# EAGLE design Dashboard rev2 (EAGLE 9.6.2)
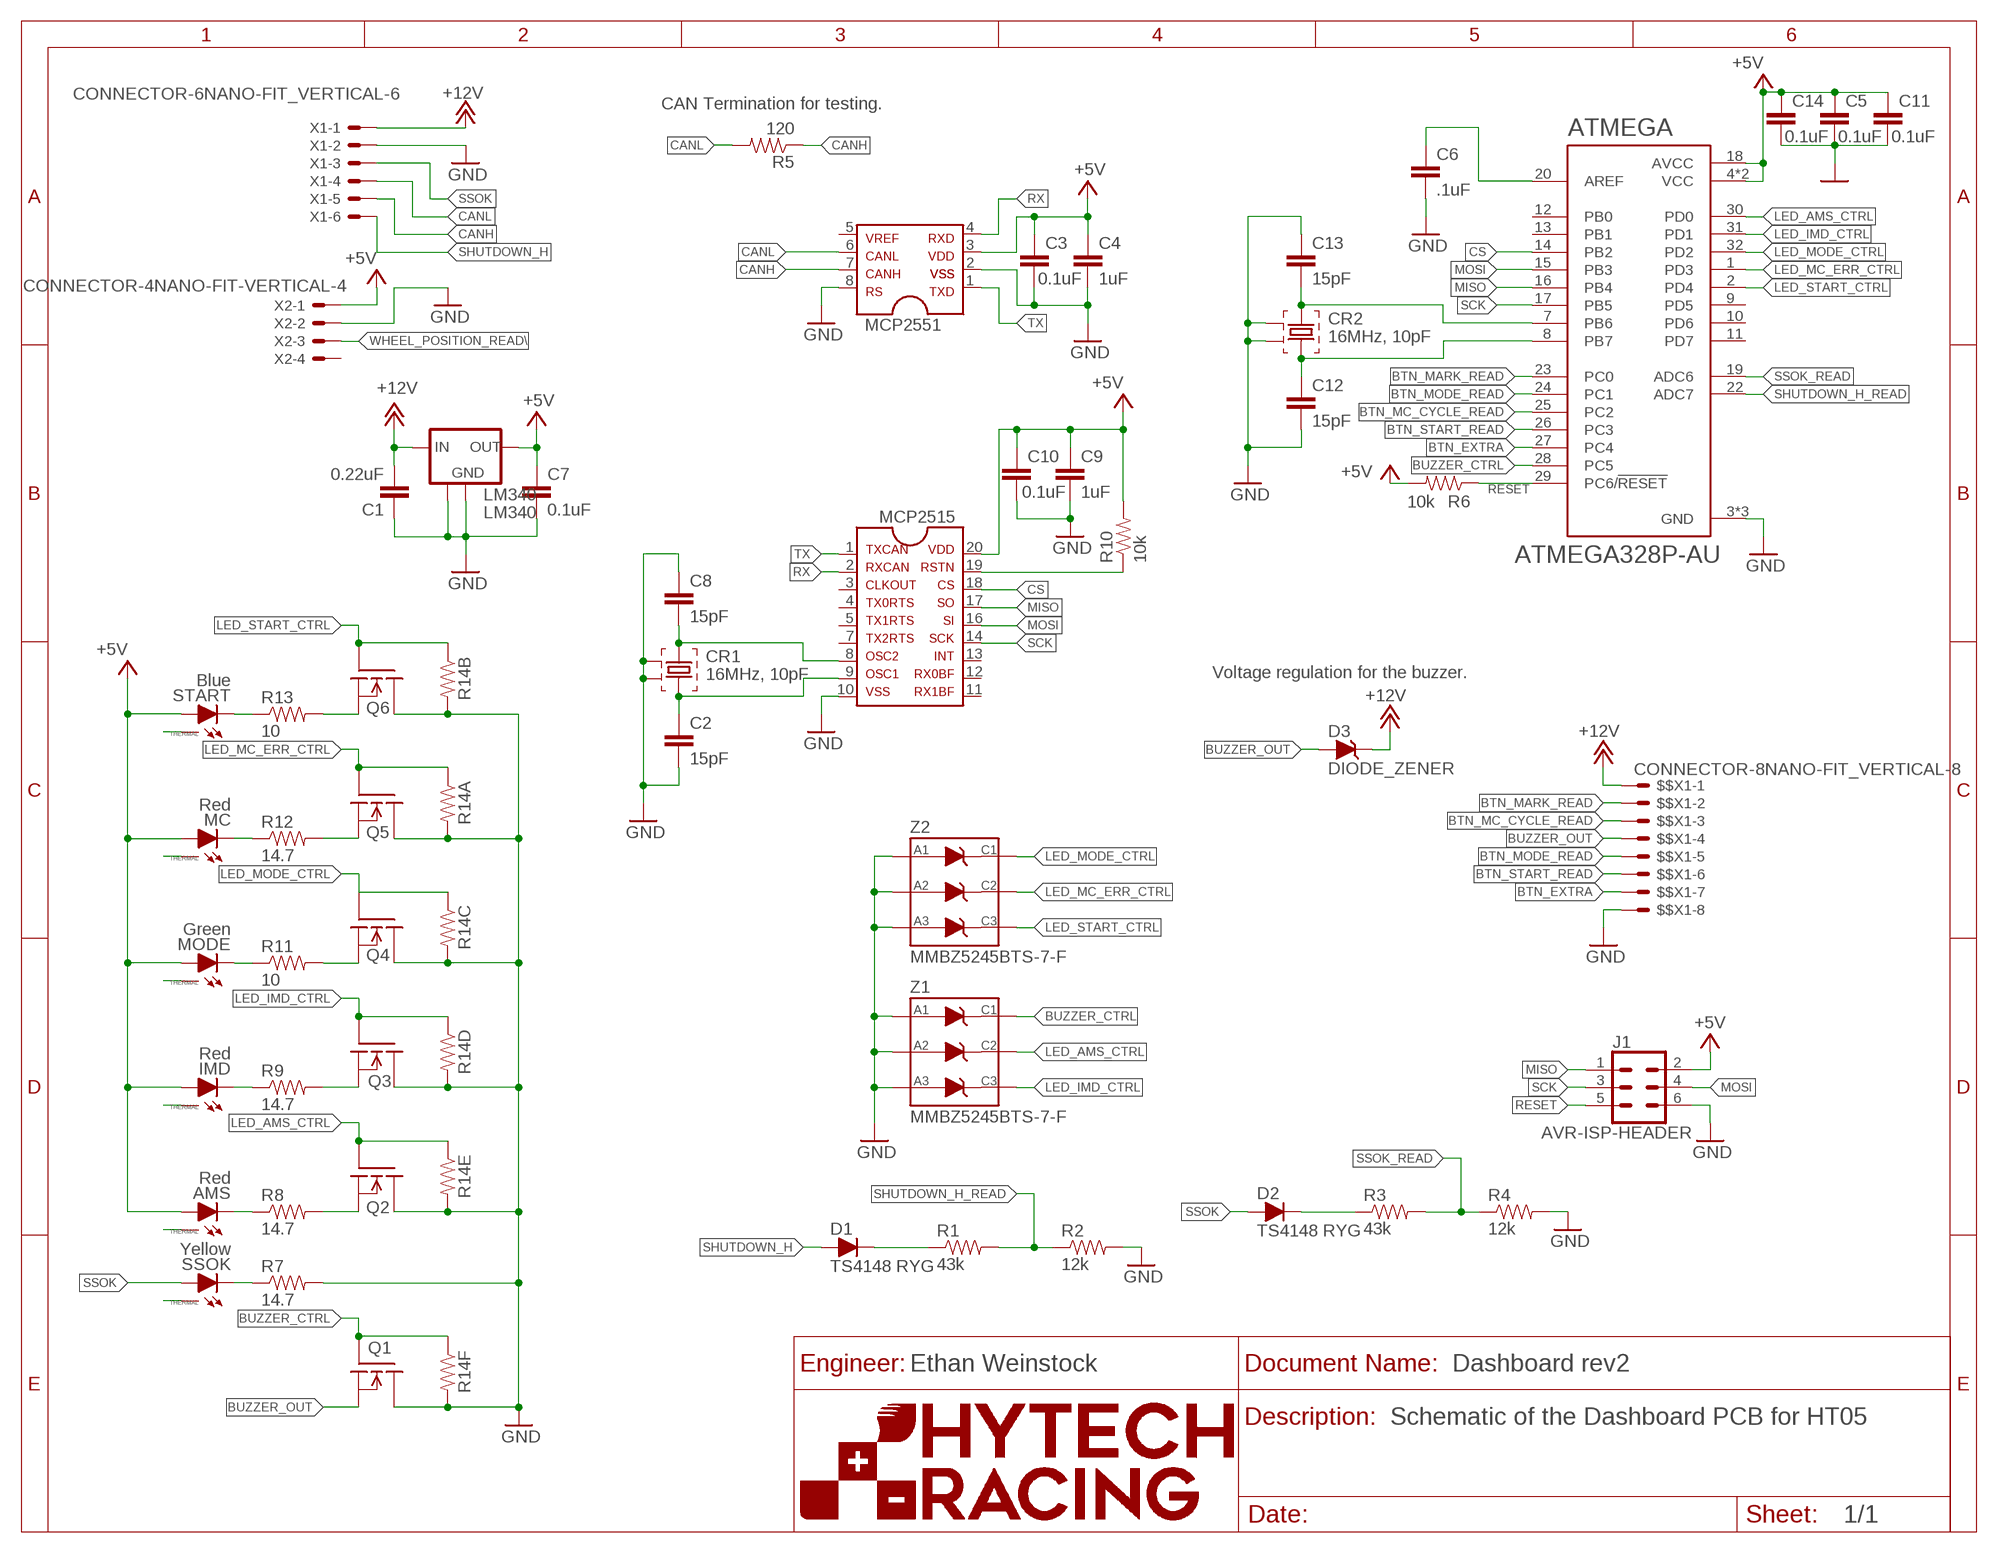
[diagram p0: schematic, sheet 1]
U$1 (FRAME_A_L): ORIENTATION: LANDSCAPE; SIZE: A

## Parts
$$X1  CONNECTOR-8NANO-FIT_VERTICAL-8  [NANO-FIT_VERTICAL-8]
AMS  Red  XP-E2XP-E2  [XP-E2]
ATMEGA  ATMEGA328P-AU  [QFP80P900X900X120-32N]
C1  0.22uF  CAP0603-CAP  [0603-CAP]
C2  15pF  CAP0603-CAP  [0603-CAP]
C3  0.1uF  CAP0603-CAP  [0603-CAP]
C4  1uF  CAP0603-CAP  [0603-CAP]
C5  0.1uF  CAP0603-CAP  [0603-CAP]
C6  .1uF  CAP0603-CAP  [0603-CAP]
C7  0.1uF  CAP0603-CAP  [0603-CAP]
C8  15pF  CAP0603-CAP  [0603-CAP]
C9  1uF  CAP0603-CAP  [0603-CAP]
C10  0.1uF  CAP0603-CAP  [0603-CAP]
C11  0.1uF  CAP0603-CAP  [0603-CAP]
C12  15pF  CAP0603-CAP  [0603-CAP]
C13  15pF  CAP0603-CAP  [0603-CAP]
C14  0.1uF  CAP0603-CAP  [0603-CAP]
CR1  16MHz, 10pF  ABM3B  [ABM3B]
CR2  16MHz, 10pF  ABM3B  [ABM3B]
D1  TS4148 RYG  DIODE0805  [0805_D]
D2  TS4148 RYG  DIODE0805  [0805_D]
D3  DIODE_ZENER  [SOT23]
IMD  Red  XP-E2XP-E2  [XP-E2]
J1  AVR-ISP-HEADER  [2X03]
LM340  LM340  [SOT223]
MC  Red  XP-E2XP-E2  [XP-E2]
MCP2515  MCP2515TSSOP  [TSSOP-20]
MCP2551  MCP2551  [SOIC-08]
MODE  Green  XP-E2XP-E2  [XP-E2]
Q1  DMG3406LSOT  [SOT23]
Q2  DMG3406LSOT  [SOT23]
Q3  DMG3406LSOT  [SOT23]
Q4  DMG3406LSOT  [SOT23]
Q5  DMG3406LSOT  [SOT23]
Q6  DMG3406LSOT  [SOT23]
R1  43k  RESISTOR0603  [0603-RES]
R2  12k  RESISTOR0603  [0603-RES]
R3  43k  RESISTOR0603  [0603-RES]
R4  12k  RESISTOR0603  [0603-RES]
R5  120  RESISTOR0603-RES  [0603-RES]
R6  10k  RESISTOR0603  [0603-RES]
R7  14.7  RESISTOR0603  [0603-RES]
R8  14.7  RESISTOR0603  [0603-RES]
R9  14.7  RESISTOR0603  [0603-RES]
R10  10k  RESISTOR0603  [0603-RES]
R11  10  RESISTOR0603  [0603-RES]
R12  14.7  RESISTOR0603  [0603-RES]
R13  10  RESISTOR0603  [0603-RES]
R14  10k  YC248-JR-0710KL  [YAG_YC248-M]
SSOK  Yellow  XP-E2XP-E2  [XP-E2]
START  Blue  XP-E2XP-E2  [XP-E2]
X1  CONNECTOR-6NANO-FIT_VERTICAL-6  [NANO-FIT_VERTICAL-6]
X2  CONNECTOR-4NANO-FIT-VERTICAL-4  [NANO-FIT_VERTICAL-4]
Z1  MMBZ5245BTS-7-F  [SOT363]
Z2  MMBZ5245BTS-7-F  [SOT363]

## Nets
+5V: AMS.A ATMEGA.4(VCC) ATMEGA.6(VCC) ATMEGA.18(AVCC) C3.1 C4.1 C5.1 C7.1 C9.1 C10.1 C11.1 C14.1 IMD.A J1.2 LM340.3(OUT) MC.A MCP2515.20(VDD) MCP2551.3 MODE.A R6.2 R10.2 START.A X2.P$1
+12V: $$X1.P$1 C1.2 D3.3(C) LM340.1(IN) X1.P$1
BTN_EXTRA: $$X1.P$7 ATMEGA.27(PC4)
BTN_MARK_READ: $$X1.P$2 ATMEGA.23(PC0)
BTN_MC_CYCLE_READ: $$X1.P$3 ATMEGA.25(PC2)
BTN_MODE_READ: $$X1.P$5 ATMEGA.24(PC1)
BTN_START_READ: $$X1.P$6 ATMEGA.26(PC3)
BUZZER_CTRL: ATMEGA.28(PC5) Q1.1(G) R14.6 Z1.P$4(C1)
BUZZER_OUT: $$X1.P$4 D3.1(A) Q1.2(S)
CANH: MCP2551.7 R5.1 X1.P$5
CANL: MCP2551.6 R5.2 X1.P$4
CS: ATMEGA.14(PB2) MCP2515.18(CS)
GND: $$X1.P$8 ATMEGA.3(GND) ATMEGA.5(GND) ATMEGA.21(GND) C1.1 C2.2 C3.2 C4.2 C5.2 C6.2 C7.2 C8.1 C9.2 C10.2 C11.2 C12.2 C13.1 C14.2 CR1.P$2 CR1.P$4 CR2.P$2 CR2.P$4 J1.6 LM340.2(GND) LM340.4(GND1) MCP2515.10(VSS) MCP2551.2 MCP2551.8 Q1.3(D) Q2.3(D) Q3.3(D) Q4.3(D) Q5.3(D) Q6.3(D) R2.2 R4.2 R7.2 R14.11 R14.12 R14.13 R14.14 R14.15 R14.16 X1.P$2 X2.P$2 Z1.P$1(A1) Z1.P$2(A2) Z1.P$3(A3) Z2.P$1(A1) Z2.P$2(A2) Z2.P$3(A3)
LED_AMS_CTRL: ATMEGA.30(PD0) Q2.1(G) R14.5 Z1.P$5(C2)
LED_IMD_CTRL: ATMEGA.31(PD1) Q3.1(G) R14.4 Z1.P$6(C3)
LED_MC_ERR_CTRL: ATMEGA.1(PD3) Q5.1(G) R14.1 Z2.P$5(C2)
LED_MODE_CTRL: ATMEGA.32(PD2) Q4.1(G) R14.3 Z2.P$4(C1)
LED_START_CTRL: ATMEGA.2(PD4) Q6.1(G) R14.2 Z2.P$6(C3)
MISO: ATMEGA.16(PB4) J1.1 MCP2515.17(SO)
MOSI: ATMEGA.15(PB3) J1.4 MCP2515.16(SI)
N$1: MCP2515.19(RSTN) R10.1
N$2: C2.1 CR1.P$3 MCP2515.9(OSC1)
N$3: C8.2 CR1.P$1 MCP2515.8(OSC2)
N$4: Q6.2(S) R13.2
N$5: ATMEGA.7(PB6) C13.2 CR2.P$1
N$6: ATMEGA.8(PB7) C12.1 CR2.P$3
N$7: D2.C R3.1
N$8: ATMEGA.20(AREF) C6.1
N$9: Q4.2(S) R11.2
N$10: MODE.C R11.1
N$11: R13.1 START.C
N$12: Q3.2(S) R9.2
N$13: IMD.C R9.1
N$14: D1.C R1.1
N$15: R7.1 SSOK.C
N$16: AMS.C R8.1
N$17: Q2.2(S) R8.2
N$18: Q5.2(S) R12.2
N$19: MC.C R12.1
RESET: ATMEGA.29(PC6/!RESET) J1.5 R6.1
RX: MCP2515.2(RXCAN) MCP2551.4
SCK: ATMEGA.17(PB5) J1.3 MCP2515.14(SCK)
SHUTDOWN_H: D1.A X1.P$6
SHUTDOWN_H_READ: ATMEGA.22(ADC7) R1.2 R2.1
SSOK: D2.A SSOK.A X1.P$3
SSOK_READ: ATMEGA.19(ADC6) R3.2 R4.1
THERMAL: AMS.X IMD.X MC.X MODE.X SSOK.X START.X
TX: MCP2515.1(TXCAN) MCP2551.1
WHEEL_POSITION_READ\: X2.P$3
Unconnected: ATMEGA.9(PD5) ATMEGA.10(PD6) ATMEGA.11(PD7) ATMEGA.12(PB0) ATMEGA.13(PB1) MCP2515.3(CLKOUT) MCP2515.4(TX0RTS) MCP2515.5(TX1RTS) MCP2515.7(TX2RTS) MCP2515.11(RX1BF) MCP2515.12(RX0BF) MCP2515.13(INT) MCP2551.5 R14.7 R14.8 R14.9 R14.10 X2.P$4

## Notes on the sheet
- CAN Termination for testing.
- Voltage regulation for the buzzer.
- Ethan Weinstock
- Schematic of the Dashboard PCB for HT05

## Library data of the parts
$$X1 = HyTechDevices:CONNECTOR-8: Mini-Fit Junior connector 8 pole Source: http://www.molex.com
AMS IMD MC MODE SSOK START = HyTechDevices:XP-E2: XP-E2 high-brightness LED. Data sheet <https://www.cree.com/led-components/media/documents/XLampXPE2.pdf>
ATMEGA = HyTechDevices:ATMEGA328P-AU: ATmega Series 20 MHz 32 KB Flash 2 KB SRAM 8-Bit Microcontroller - TQFP-32; AVAILABILITY: Unavailable; DESCRIPTION: AVR AVR® ATmega Microcontroller IC 8-Bit 20MHz 32KB _16K x 16_ FLASH 32-TQFP _7x7_; MF: Microchip; MP: ATMEGA328P-AU; PACKAGE: TQFP-32 Microchip; PRICE: None
C1-C14 = HyTechDevices:CAP: Capacitor Standard 0603 ceramic capacitor, and 0.1" leaded capacitor.
CR1 CR2 = HyTechDevices:ABM3B: ABM3B ceramic SMD crystal. Datasheet <https://www.mouser.com/datasheet/2/3/abm3b-39910.pdf>
D1 D2 = HyTechDevices:DIODE: DIODE general purpose rectifier
D3 = HyTechDevices:DIODE_ZENER: ZENER DIODE
J1 = HyTechDevices:AVR-ISP-HEADER: AVR ISP 6-pin Header Reference <https://en.wikipedia.org/wiki/In-system_programming>; DIGIKEY: S2011EC-03-ND
LM340 = HyTechDevices:LM340
MCP2515 = HyTechDevices:MCP2515: MCP2515 CAN Controller with SPI Interface Datasheet <http://ww1.microchip.com/downloads/en/DeviceDoc/21801G.pdf>
MCP2551 = HyTechDevices:MCP2551: MCP2551 High-Speed CAN Transceiver Product Webpage <https://www.microchip.com/wwwproducts/en/MCP2551> Datasheet <http://ww1.microchip.com/downloads/en/DeviceDoc/21667f.pdf> This device is outdated It is replaced by MCP2561. Comparison Page <https://www.microchip.com/wwwproducts/ProductCompare/MCP2551/MCP2561> Product Webpage <https://www.microchip.com/wwwproducts/en/MCP2561> Datasheet <http://ww1.microchip.com/downloads/en/DeviceDoc/20005167C.pdf>
Q1-Q6 = HyTechDevices:DMG3406L: Generic NPN MOSFET DMG3406L (SOT-23, 2.8 A 30V)
R1-R13 = HyTechDevices:RESISTOR: Resistor Basic schematic elements and footprints for 0603, 1206, and PTH resistors.
R14 = HyTechDevices:YC248-JR-0710KL: 10k 8-resistor array. Replaces Bourns Cat 16 Datasheet <https://www.yageo.com/upload/media/product/productsearch/datasheet/rchip/PYu-YC_TC_group_51_RoHS_L_9.pdf>; BUILT_BY: EMA_UL_Team; MANUFACTURER_PART_NUMBER: YC248-JR-0710KL; VENDOR: Yageo
X1 = HyTechDevices:CONNECTOR-6: Mini-Fit Junior connector 6 pole Source: http://www.molex.com
X2 = HyTechDevices:CONNECTOR-4: Mini-Fit Junior connector 4 pole Source: http://www.molex.com
Z1 Z2 = HyTechDevices:MMBZ5245BTS-7-F: 15V Zener Diode Array 3 Independent with SOT363 footprint. Datasheet <https://www.mouser.com/datasheet/2/115/ds30184-1382386.pdf>; VOLTAGE: 15V

## Board
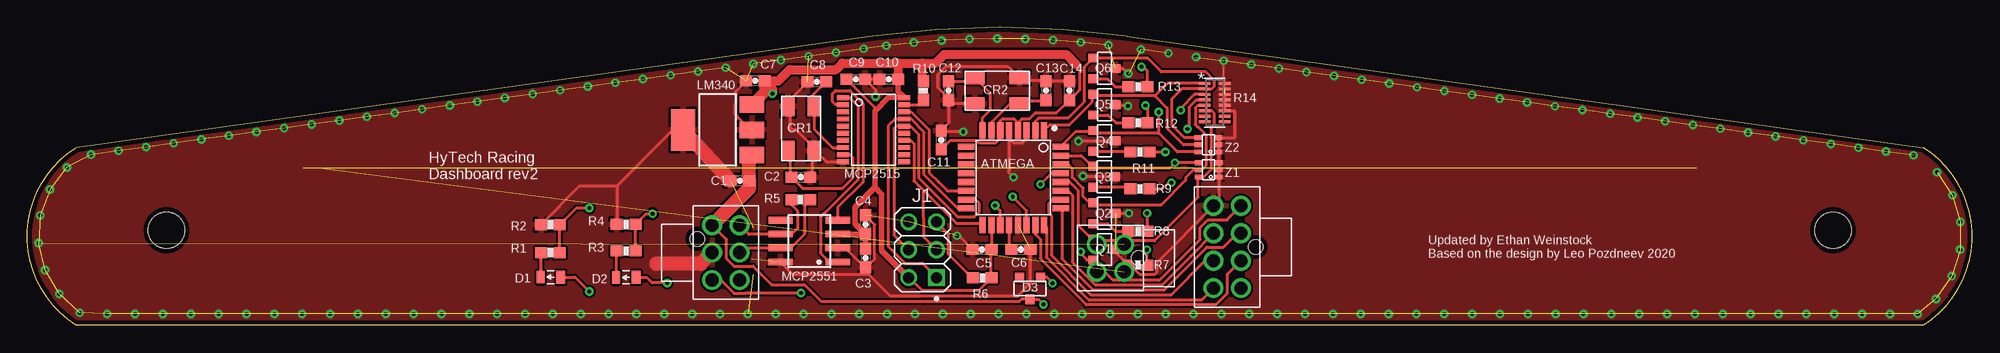
[diagram p1: board, top side]
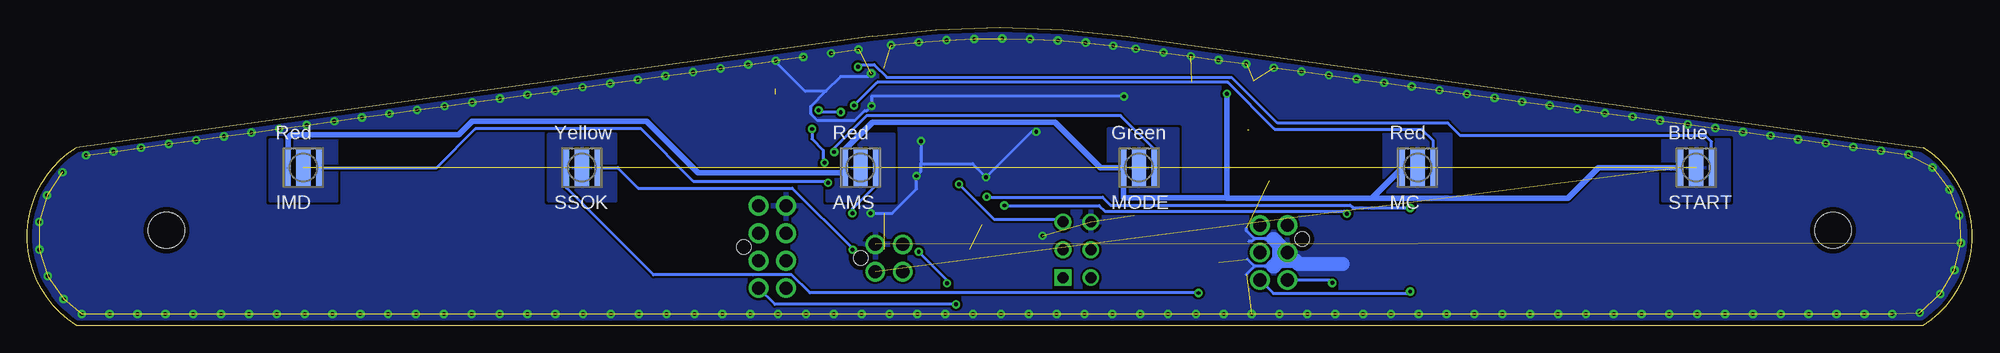
[diagram p2: board, bottom side, seen from below]

Size 177.34 x 27.14 mm. Coordinates in mm from the lower left corner, seen from the top.
Outline: 100.26,26.32 arc16 77.08,26.32 4.45,16.19 arc115 4.45,0 172.89,0 arc115 172.89,16.19 100.26,26.32
Copper layers (1*16): Top 0.035mm / dielectric 1.53mm / Bottom 0.035mm
Design rules "HyTech Default (2 Layer)": minimum track width 8mil, minimum drill 0.3mm, track to track 8mil, track to pad 8mil, pad to pad 8mil, via to via 22mil, smd to smd 8mil, copper to edge 17mil, drill to drill 23mil, minimum pad ring 9mil, minimum via ring 8mil, stop-mask expansion 8mil, vias tented up to drill 30mil, thermal gap 10mil
Holes 3.3 mm at 12.69,8.65 164.65,8.65

### Footprints (pad centres in the part's own frame; a part is rotated, then mirrored left to right if it is on the bottom)
NANO-FIT_VERTICAL-8 = drill 1.2: P$1 -3.75,0; P$2 -1.25,0; P$3 1.25,0; P$4 3.75,0; P$5 -3.75,2.5; P$6 -1.25,2.5; P$7 1.25,2.5; P$8 3.75,2.5 | hole 1.3: 0,-1.34
XP-E2 = smd 0.5 x 3.3: A -1.4,0; C 1.4,0 | smd 1.3 x 3.3: X 0,0
QFP80P900X900X120-32N = smd 1.5 x 0.55: 1 -4.3,2.8; 2 -4.3,2; 3 -4.3,1.2; 4 -4.3,0.4; 5 -4.3,-0.4; 6 -4.3,-1.2; 7 -4.3,-2; 8 -4.3,-2.8; 17 4.3,-2.8; 18 4.3,-2; 19 4.3,-1.2; 20 4.3,-0.4; 21 4.3,0.4; 22 4.3,1.2; 23 4.3,2; 24 4.3,2.8 | smd 0.55 x 1.5: 9 -2.8,-4.3; 10 -2,-4.3; 11 -1.2,-4.3; 12 -0.4,-4.3; 13 0.4,-4.3; 14 1.2,-4.3; 15 2,-4.3; 16 2.8,-4.3; 25 2.8,4.3; 26 2,4.3; 27 1.2,4.3; 28 0.4,4.3; 29 -0.4,4.3; 30 -1.2,4.3; 31 -2,4.3; 32 -2.8,4.3
0603-CAP = smd 1.1 x 1: 1 -0.85,0; 2 0.85,0
ABM3B = smd 1.803 x 1.194: P$1 0.902,2.985; P$2 4.966,2.985; P$3 4.966,0.597; P$4 0.902,0.597
0805_D = smd 0.8 x 1.2: A -0.9,0; C 0.9,0
SOT23 = smd 0.8 x 0.9: 1 -0.95,-1; 2 0.95,-1; 3 0,1
2X03 = drill 1.016 square: 1 -2.54,-1.27 | drill 1.016: 2 -2.54,1.27; 3 0,-1.27; 4 0,1.27; 5 2.54,-1.27; 6 2.54,1.27
SOT223 = smd 1.5 x 2.235: 1 -2.3,-3.15; 2 0,-3.15; 3 2.3,-3.15 | smd 3.8 x 2.2: 4 0,3.15
TSSOP-20 = smd 0.45 x 1.1: 1 -2.925,-2.618; 2 -2.275,-2.618; 3 -1.625,-2.618; 4 -0.975,-2.618; 5 -0.325,-2.618; 6 0.325,-2.618; 7 0.975,-2.618; 8 1.625,-2.618; 9 2.275,-2.618; 10 2.925,-2.618; 11 2.925,2.918; 12 2.275,2.918; 13 1.625,2.918; 14 0.975,2.918; 15 0.325,2.918; 16 -0.325,2.918; 17 -0.975,2.918; 18 -1.625,2.918; 19 -2.275,2.918; 20 -2.925,2.918
SOIC-08 = smd 0.6 x 2.2: 1 -1.905,-2.6; 2 -0.635,-2.6; 3 0.635,-2.6; 4 1.905,-2.6; 5 1.905,2.6; 6 0.635,2.6; 7 -0.635,2.6; 8 -1.905,2.6
0603-RES = smd 1.1 x 1: 1 -0.85,0; 2 0.85,0
YAG_YC248-M = smd 1.067 x 0.254: 1 -0.902,1.75; 2 -0.902,1.25; 3 -0.902,0.75; 4 -0.902,0.25; 5 -0.902,-0.25; 6 -0.902,-0.75; 7 -0.902,-1.25; 8 -0.902,-1.75; 9 0.902,-1.75; 10 0.902,-1.25; 11 0.902,-0.75; 12 0.902,-0.25; 13 0.902,0.25; 14 0.902,0.75; 15 0.902,1.25; 16 0.902,1.75
NANO-FIT_VERTICAL-6 = drill 1.2: P$1 -2.5,0; P$2 0,0; P$3 2.5,0; P$4 -2.5,2.5; P$5 0,2.5; P$6 2.5,2.5 | hole 1.3: -1.25,-1.34
NANO-FIT_VERTICAL-4 = drill 1.2: P$1 -1.25,0; P$2 1.25,0; P$3 -1.25,2.5; P$4 1.25,2.5 | hole 1.3: 0,-1.34
SOT363 = smd 0.61 x 0.432: P$1 -0.965,0.673; P$2 -0.965,0.023; P$3 -0.965,-0.627; P$4 0.93,0.673; P$5 0.93,0.023; P$6 0.93,-0.627

### Placement (x,y rotation side)
$$X1  110.66,7.12 90 top
AMS  101.37,14.36 0 bottom
ATMEGA  89.91,13.45 270 top
C1  64.96,13.17 0 top
C2  70.53,13.5 0 top
C3  76.43,6.13 270 top
C4  76.43,9.15 90 top
C5  87.04,6.89 180 top
C6  90.6,6.89 0 top
C7  66.38,22.26 180 top
C8  71.98,22.18 0 top
C9  75.54,22.41 0 top
C10  78.56,22.41 180 top
C11  83.33,16.87 90 top
C12  83.99,21.37 270 top
C13  92.88,21.37 270 top
C14  95.02,21.37 90 top
CR1  68.75,20.86 270 top
CR2  91.36,23.15 180 top
D1  47.71,4.37 180 top
D2  54.6,4.36 180 top
D3  91.43,3.34 180 top
IMD  152.17,14.36 0 bottom
J1  81.63,6.87 90 top
LM340  62.93,17.79 90 top
MC  50.57,14.36 0 bottom
MCP2515  77.01,17.81 270 top
MCP2551  71.29,7.65 90 top
MODE  75.97,14.36 0 bottom
Q1  98.22,6.89 270 top
Q2  98.22,10.19 270 top
Q3  98.19,13.52 270 top
Q4  98.22,16.8 270 top
Q5  98.22,20.1 270 top
Q6  98.22,23.4 270 top
R1  47.69,6.62 0 top
R2  47.69,9.16 180 top
R3  54.6,6.77 0 top
R4  54.6,9.18 180 top
R5  70.52,11.44 180 top
R6  87.07,4.31 0 top
R7  101.27,5.47 180 top
R8  101.27,8.54 180 top
R9  101.46,12.42 180 top
R10  81.71,21.37 90 top
R11  101.46,15.78 180 top
R12  101.27,18.45 180 top
R13  101.27,21.73 180 top
R14  108.27,20.28 0 top
SSOK  126.77,14.36 0 bottom
START  25.17,14.36 0 bottom
X1  62.44,6.61 270 top
X2  100.01,6.11 90 top
Z1  107.69,14.17 180 top
Z2  107.67,16.46 180 top

### Tracks (layer width: path | path; a pad name or v marks a point on that pad's centre or on a via)
+5V  (via drill 0.35)  (1 unrouted)
  Top 0.254: ATMEGA.18 87.91,6.91 C5.1 87.89,4.34 R6.2 86.74,3.12 81.62,3.12 80.41,4.33 J1.2 | C11.1 84.16,16.85 86.5,16.85 86.73,16.61 88.3,16.61 88.72,17.03 88.72,17.74 ATMEGA.6 88.71,18.59 88.95,18.82 89.96,18.82 90.33,18.46 90.3,18.43 ATMEGA.4 90.32,18.44 90.7,18.83 91.39,18.83 91.93,19.36 93.85,19.36 C14.1 95.92,21.43 95.92,23.45 95.64,23.74 | 77.28,19.52 77.28,19.82 C9.1
  Top 0.406: MCP2515.20 79.89,20.78
  Top 0.508: J1.2 77.89,6.8 77.89,11.95 77.28,12.56 | C4.1 75.47,9.26 75.47,10.74 77.28,12.55 77.28,12.56 | C3.1 C4.1 | 77.28,12.56 77.28,19.52 78.54,20.78 79.89,20.78 79.96,20.78 79.41,21.33 C10.1 | MCP2551.3 73.91,8.3 C4.1
  Top 0.813: 79.41,23.88 74.33,23.88 73.74,23.29 69.51,23.29 68.48,22.26 C7.1 67.95,21.55 v67.95,21.09 | 79.41,23.88 81.62,23.88 | 81.62,23.88 82.81,23.88 83.61,24.68 94.69,24.68 95.64,23.74 | 79.41,23.88 C10.1 | R10.2 81.62,22.31 81.62,23.88
  Top 1.016: LM340.3 67.23,21.25 C7.1
  Bottom 0.508: v67.95,21.09 67.95,11.59 | 54.75,11.58 36.88,11.58 34.1,14.36 START.A | 67.95,11.59 77.37,11.59 MODE.A 79.5,14.36 83.64,18.51 100.29,18.51 102.77,16.03 102.77,15.54 AMS.A 102.77,13.91 116.16,13.91 120.86,18.61 136.76,18.61 138.01,17.35 153.29,17.35 153.57,17.07 IMD.A | MC.A 54.75,11.58 | 67.95,11.59 67.93,11.58 54.75,11.58
+12V  (via drill 0.35)
  Top 0.254: v92.65,1.89 92.2,2.34 D3.3 90.63,2.34 90.46,2.17 72.38,2.17 70.86,3.69 67.87,3.69 66.17,5.38 64.43,5.38 63.71,6.1 63.71,7.84 X1.P$1
  Top 1.27: X1.P$1 65.81,12.48 C1.2 65.81,15.22 LM340.1
  Bottom 0.254: v92.65,1.89 109.18,1.89 $$X1.P$1
BTN_EXTRA
  Top 0.254: ATMEGA.27 94.91,12.24 95.3,11.85 95.3,10.24 95.3,5.73 97.34,3.69 103.5,3.69 106.09,6.28 106.09,6.29 $$X1.P$7
BTN_MARK_READ
  Top 0.254: ATMEGA.23 91.91,8.28 92.36,7.83 92.36,6.05 96.58,1.84 108.37,1.84 109.39,2.86 109.39,4.6 $$X1.P$2
BTN_MC_CYCLE_READ
  Top 0.254: ATMEGA.25 94.33,10.53 94.33,6.05 97.15,3.23 103.69,3.23 107.56,7.1 109.08,7.1 110.35,8.37 $$X1.P$3
BTN_MODE_READ
  Top 0.254: ATMEGA.24 92.91,8.95 92.91,6.18 96.77,2.32 107.11,2.32 $$X1.P$5
BTN_START_READ
  Top 0.254: ATMEGA.26 93.52,11.44 93.13,11.06 93.13,10.22 93.36,9.98 93.36,6.37 96.96,2.78 104.31,2.78 107.4,5.87 $$X1.P$6
BUZZER_CTRL
  Top 0.254: ATMEGA.28 94.27,13.1 95,13.1 95.82,12.29 95.82,9.1 97.07,7.84 Q1.1 97.22,7.7 100.42,7.7 100.43,7.69 102.78,7.69 106.76,11.67 Z1.P$4 106.92,13.34 107.12,13.34 107.99,14.22 107.99,18.03 108.23,18.27 108.23,19.3 108,19.53 R14.6
BUZZER_OUT  (via drill 0.35)
  Top 0.254: v93.48,3.82 92.97,4.34 D3.1 | v96.05,6.68 96.05,6.49 96.6,5.94 Q1.2 97.22,5.89 98.96,4.15 103.29,4.15 106.93,7.8 106.93,8.88 107.65,9.6 109.39,9.6 $$X1.P$4
  Bottom 0.254: v96.05,6.68 93.48,4.11 v93.48,3.82
CANH
  Top 0.254: X1.P$5 65.32,6.99 68.35,6.99 68.38,7.02 MCP2551.7 69.58,7.02 70.87,8.3 70.87,10.93 R5.1
CANL
  Top 0.254: X1.P$4 65.79,8.26 68.35,8.26 68.38,8.29 MCP2551.6 68.75,8.34 69.74,8.34 70.26,8.86 70.26,10.38 69.67,10.96 R5.2
CS
  Top 0.254: MCP2515.18 80.58,19.44 82.23,17.79 82.23,13.9 83.08,13.05 83.89,12.24 ATMEGA.14
GND  (via drill 0.35)  (157 unrouted)
  Top 0.203: R14.16 v109.09,24.1
  Top 0.254: C3.2 76.32,5.28 74.46,7.15 74.02,7.15 MCP2551.2 | C4.2 76.43,9.99 77.26,9.16 77.26,6.02 76.51,5.28 C3.2 | C2.2 71.56,13.67 71.56,15.72 CR1.P$2 | CR1.P$2 71.85,15.9 72.86,14.88 MCP2515.10 | CR1.P$2 71.74,16.16 70.09,17.81 69.53,17.81 69.53,19.78 CR1.P$4 69.53,20.14 69.53,20.53 71.13,22.13 C8.1 | C10.2 C9.2 77.34,21.45 v77.34,20.84 | C7.2 64.56,21.29 64.55,19.2 65.94,17.81 | CR2.P$4 90.71,22.3 92.81,22.3 C13.1 92.91,22.25 94.99,22.25 C14.2 | C3.2 76.26,5.11 76.72,4.66 | CR2.P$4 89.7,22.55 | Q4.3 99.19,16.77 v95.86,16.77 | Q2.3 v100.44,10.19 | Q1.3 99.18,6.86 99.18,6.7 R7.2 100.6,5.47 101.43,4.64 102.8,4.64 103,4.83 103,5.7 $$X1.P$8 108.66,11.36 Z1.P$1 Z1.P$2 Z1.P$3 108.63,14.82 Z2.P$1 Z2.P$2 Z2.P$3 110.1,17.08 110.1,19.53 R14.11 R14.12 R14.13 R14.14 R14.16 | C12.2 83.99,18.38 C11.2 83.43,17.62 v85.34,17.62 | C6.2 91.45,3.8 90.29,2.65 78.72,2.65 76.72,4.66 | v89.92,13.49 89.45,13.95 89.5,14 ATMEGA.5 89.51,17.02 89.9,16.64 90.73,16.64 91.11,17.02 ATMEGA.3 | C12.2 83.99,20.7 83.05,21.64 83.05,22.86 83.79,23.59 89.42,23.59 CR2.P$4 | 59.81,17.75 58.82,17.75 53.76,12.69 | R4.2 53.76,12.69 | Q3.3 96.32,13.52 v96.25,13.59 | Q6.3 99.92,23.4 v100.39,22.93 | v100.37,19.98 99.34,19.98 Q5.3 | C5.2 84.94,8.14 v84.77,8.14 | R2.2 50.37,12.69 53.76,12.69 | MCP2551.8 69.79,4.66 76.72,4.66 | CR2.P$2 84.35,20.16 C12.2
  Top 1.27: 59.81,17.75 61.79,15.64 | 61.79,15.64 C1.1 | X1.P$2 61.41,5.58 57.37,5.58 57.34,5.6 | 61.79,15.64 59.78,17.65 LM340.4
  Bottom 0.254: v100.39,22.93 100.67,22.65 103.19,22.65 104.54,21.31 | v85.34,17.62 85.78,17.62 v89.92,13.49 91.14,14.72 95.81,14.72 95.86,14.76 | v100.44,10.19 98.49,10.19 96.25,12.43 v96.25,13.59 95.86,13.98 95.86,14.76 | v95.86,16.77 95.86,14.76 | v77.34,20.84 100.37,20.84 v100.37,19.98 100.79,19.55 100.99,19.55 101.88,18.66 105.31,18.66 105.94,19.28 105.94,19.91 104.54,21.31 | 104.54,21.31 106.42,21.31 109.09,23.97 v109.09,24.1 | 66.17,4.62 65.45,5.34 64.47,5.34 64.43,5.38 | X1.P$2 63.2,6.61 64.43,5.38 | 64.43,5.38 65.45,5.38 66.08,6.01 | 65.96,7.63 65.98,7.63
  Bottom 0.279: 65.96,7.63 65.68,7.63 65.46,7.86 63.69,7.86 X1.P$2 | 66.19,8.86 66.19,8.6 65.46,7.87 64.45,7.87 64.44,7.86 64.41,7.86
  Bottom 0.305: 63.69,7.82 63.73,7.86 64.41,7.86 64.42,7.86
  Bottom 1.27: X1.P$2 61.41,5.58 | 61.41,5.58 57.38,5.58 | X1.P$2 63.69,5.36 | 63.73,5.36 63.69,5.36 | X1.P$2 63.69,7.86 | 63.73,7.86 63.69,7.86 | 63.72,5.38 63.2,5.89 63.2,7.33 63.69,7.82 63.69,7.86 | 63.69,5.36 63.65,5.36 63.16,5.85 61.72,5.85 61.45,5.58 61.41,5.58
  other vias: 172.38,1.02 169.84,1.02 167.3,1.02 164.76,1.02 162.22,1.02 159.68,1.02 157.14,1.02 154.6,1.02 152.06,1.02 149.52,1.02 146.98,1.02 144.44,1.02 141.9,1.02 139.36,1.02 136.82,1.02 134.28,1.02 131.74,1.02 129.2,1.02 126.66,1.02 124.12,1.02 121.58,1.02 119.04,1.02 116.5,1.02 113.96,1.02 111.42,1.02 108.88,1.02 106.34,1.02 103.8,1.02 101.26,1.02 98.72,1.02 96.18,1.02 93.64,1.02 91.1,1.02 88.56,1.02 86.02,1.02 83.48,1.02 80.94,1.02 78.4,1.02 75.86,1.02 73.32,1.02 70.78,1.02 68.24,1.02 65.7,1.02 63.16,1.02 60.62,1.02 58.08,1.02 55.54,1.02 53,1.02 50.46,1.02 47.92,1.02 45.38,1.02 42.84,1.02 40.3,1.02 37.76,1.02 35.22,1.02 32.68,1.02 30.14,1.02 27.6,1.02 25.06,1.02 22.52,1.02 19.98,1.02 17.44,1.02 14.9,1.02 12.36,1.02 9.82,1.02 7.28,1.02 4.78,1.13 2.9,2.84 1.61,5.01 1.02,7.47 1.17,10 2.06,12.37 3.61,14.37 76.26,25.19 73.74,24.85 71.23,24.5 68.71,24.16 66.19,23.81 63.68,23.47 61.16,23.13 58.65,22.78 56.13,22.44 53.61,22.09 51.1,21.75 48.58,21.4 46.06,21.06 43.55,20.71 41.03,20.37 38.51,20.02 36,19.68 33.48,19.33 30.96,18.99 28.45,18.64 25.93,18.3 23.41,17.96 20.9,17.61 18.38,17.27 15.86,16.92 13.35,16.58 10.83,16.23 8.31,15.89 5.8,15.54 98.58,25.52 96.06,25.79 93.52,25.98 90.99,26.09 88.45,26.12 85.91,26.08 83.37,25.95 80.84,25.75 78.31,25.47 101.54,25.13 104.06,24.78 106.57,24.44 111.61,23.75 114.12,23.41 116.64,23.06 119.15,22.72 121.67,22.37 124.19,22.03 126.7,21.68 129.22,21.34 131.74,20.99 134.25,20.65 136.77,20.3 139.29,19.96 141.8,19.62 144.32,19.27 146.84,18.93 149.35,18.58 151.87,18.24 154.39,17.89 156.9,17.55 159.42,17.2 161.94,16.86 164.45,16.51 166.97,16.17 169.48,15.82 172,15.48 174.04,2.39 175.48,4.47 176.24,6.88 176.27,9.41 175.55,11.84 174.14,13.94
  pour Bottom (rank 2): -5.14,27.95 -5.14,-3.54 179.26,-3.54 179.26,24.9 179.26,27.95
  pour Top: -5.14,27.95 -5.14,-3.54 179.26,-3.54 179.26,27.95
  cutout Top: 78.91,10.74 78.91,8.69 79.27,8.32 79.9,7.7 80.14,7.7 80.18,7.7 80.23,7.75 80.54,7.75 80.58,7.71 80.67,7.71 80.73,7.65 80.77,7.65 80.85,7.57 80.91,7.57 81,7.48 81.29,7.48 81.45,7.63 81.46,7.65 81.46,9.06 81.46,9.65 80.57,10.54 80.37,10.74
LED_AMS_CTRL
  Top 0.254: R14.5 106.73,20.03 106.5,19.8 106.5,18.27 106.7,18.07 106.73,18.07 107.51,17.3 107.51,14.56 107.1,14.15 Z1.P$5 106.33,14.14 105.62,13.43 105.62,13.2 103.4,10.98 97.39,10.98 Q2.1 96.87,11.14 96.27,11.74 96.27,12.48 95.29,13.46 95.29,14.26 94.9,14.65 ATMEGA.30
LED_IMD_CTRL  (via drill 0.35)
  Top 0.254: ATMEGA.31 96.12,15.44 97.09,14.47 Q3.1 97.3,14.37 104.21,14.37 v104.64,14.79 v104.64,14.8 Z1.P$6 | R14.4 106.59,20.53 105.94,19.88 105.94,18.03 v105.79,17.88
  Bottom 0.254: v105.79,17.88 105.79,16.97 104.77,15.95 104.77,14.92 v104.64,14.79
LED_MC_ERR_CTRL
  Top 0.254: ATMEGA.1 93.25,18.28 95.02,18.28 97.12,20.38 97.12,20.9 | Z2.P$5 105.44,16.43 103.93,17.94 103.93,19.77 102.8,20.9 | 102.8,20.9 97.12,20.9 | R14.1 103.94,22.03 102.8,20.9 | Q5.1 97.22,21 97.12,20.9
LED_MODE_CTRL  (via drill 0.35)
  Top 0.254: 97.3,17.67 97.44,17.53 103.11,17.53 103.17,17.48 | 97.3,17.67 Q4.1 | ATMEGA.32 95.64,17.67 97.3,17.67 | v105.18,19.6 105.18,19.76 106.44,21.03 107.23,21.03 107.24,21.03 R14.3 | 103.17,17.48 v103.17,19.42 | Z2.P$4 104.86,15.78 103.17,17.48
  Bottom 0.254: v103.17,19.42 105,19.42 v105.18,19.6
LED_START_CTRL
  Top 0.254: ATMEGA.2 91.9,18.52 92.26,18.88 94.93,18.88 96.41,20.36 96.41,23.54 Q6.1 97.25,24.32 102.16,24.32 103.41,23.07 107.45,23.07 108.23,22.3 108.23,21.77 107.99,21.52 R14.2 105.28,21.53 104.38,20.63 104.38,18.22 105.52,17.08 Z2.P$6
MISO
  Top 0.254: ATMEGA.16 85.57,10.69 84.78,10.69 81.77,13.7 81.77,17.58 80.55,18.8 MCP2515.17 79.1,18.79 78.48,18.17 78.48,7.18 80.02,5.65 81.63,5.65 82.9,4.38 J1.1
MOSI
  Top 0.254: ATMEGA.15 85.65,11.48 86.43,11.48 86.82,11.09 86.82,10.36 86.33,9.86 84.83,9.86 81.3,13.39 81.3,17.36 80.52,18.15 MCP2515.16 79.24,18.14 79.02,17.92 79.02,8.21 J1.4
N$1
  Top 0.254: MCP2515.19 81.71,20.1 R10.1
N$2
  Top 0.254: CR1.P$3 69.53,15.72 69.53,13.65 C2.1 70.7,12.48 74.32,12.48 75.27,13.43 75.27,15.27 74.99,15.55 MCP2515.9
N$3
  Top 0.254: MCP2515.8 73.43,16.19 71.74,17.88 CR1.P$1 71.56,20.14 71.56,20.91 C8.2
N$4
  Top 0.254: Q6.2 98.48,22.45 99.21,21.73 R13.2
N$5
  Top 0.254: C13.2 92.84,20.52 92.73,20.42 90.97,20.42 90.71,20.16 CR2.P$1 89.58,20.16 87.9,18.48 ATMEGA.7
N$6
  Top 0.254: C12.1 86.06,22.22 CR2.P$3 87.82,21.13 87.82,19.62 87.11,18.92 ATMEGA.8
N$7
  Top 0.254: R3.1 53.7,6.72 D2.C
N$8
  Top 0.254: ATMEGA.20 89.52,7.12 C6.1
N$9
  Top 0.254: Q4.2 100.51,15.85 100.58,15.78 R11.2
N$10  (via drill 0.35)
  Top 0.254: R11.1 v103.77,15.78
  Bottom 0.254: v103.77,15.78 103.77,16.12 100.8,19.09 77.65,19.09 74.57,16.01 MODE.C
N$11  (via drill 0.35)
  Top 0.254: R13.1 102.12,23.17 101.75,23.54 v101.58,23.54
  Bottom 0.254: v101.58,23.54 101.58,23.75 100.12,23.75 98.96,22.59 67.52,22.59 63.33,18.4 47.79,18.4 46.67,17.28 24.32,17.28 23.77,16.73 START.C
N$12
  Top 0.254: R9.2 100.45,12.57 Q3.2
N$13  (via drill 0.35)
  Top 0.254: v104.33,12.98 104.04,12.98 103.48,12.42 R9.1
  Bottom 0.254: v104.33,12.98 104.48,13.13 116.62,13.13 121.37,17.88 136.5,17.88 140.02,14.36 IMD.C
N$14
  Top 0.254: R1.1 46.81,6.59 D1.C
N$15  (via drill 0.35)
  Top 0.254: R7.1 102.08,5.51 v102.08,6.87
  Bottom 0.254: v102.08,6.87 102.08,6.99 107.59,12.5 121.64,12.5 123.51,14.36 SSOK.C
N$16  (via drill 0.35)
  Top 0.254: R8.1 102.12,10.18 v102.1,10.19
  Bottom 0.254: AMS.C 100.01,14.32 100.01,12.71 102.1,10.62 v102.1,10.19
N$17
  Top 0.254: Q2.2 98.53,9.24 99.23,8.54 R8.2
N$18
  Top 0.254: Q5.2 98.56,19.15 99.26,18.45 R12.2
N$19  (via drill 0.35)
  Top 0.254: R12.1 102.12,19.86 v101.95,20.02
  Bottom 0.254: v101.95,20.02 99.84,22.13 67.87,22.13 63.61,17.87 50.2,17.87 49.17,16.83 MC.C
RESET  (via drill 0.35)
  Top 0.254: v92.38,12.84 93.39,13.84 ATMEGA.29 | J1.5 84.01,8.3 84.01,6.44 86.15,4.31 R6.1
  Bottom 0.254: v92.38,12.84 89.16,9.62 83.12,9.62 J1.5
RX
  Top 0.254: MCP2515.2 73.69,20.09 73.42,20.37 73.42,21.1 73.68,21.37 75.02,21.37 76.2,20.19 76.2,13.03 73.89,10.73 MCP2551.4
SCK
  Top 0.254: MCP2515.14 79.95,16.82 80.57,16.82 80.83,16.55 80.83,13.15 81.24,12.74 81.71,12.27 | 81.71,12.27 84.71,9.28 86.98,9.28 ATMEGA.17 | J1.3 81.71,8.06 81.71,9.79 81.71,12.27
SHUTDOWN_H  (via drill 0.35)
  Top 0.254: D1.A 49.94,4.37 v51.24,3.06
  Bottom 0.254: v51.24,3.06 51.42,2.88 63.71,2.88 X1.P$6
SHUTDOWN_H_READ  (via drill 0.35)
  Top 0.254: ATMEGA.22 91.11,10.44 v89.85,11.7 | R1.2 R2.1 50.06,10.68 v51.24,10.68
  Bottom 0.254: v51.24,10.68 56.47,10.68 56.73,10.94 78.58,10.94 79.3,11.66 89.81,11.66 v89.85,11.7
SSOK  (via drill 0.35)
  Top 0.254: v58.34,3.85 56.97,3.85 56.46,4.36 D2.A | X1.P$3 63.2,4.11 64.43,2.88 65.45,2.88 65.5,2.93 v70.55,2.93
  Bottom 0.254: X1.P$3 58.61,4.11 v58.34,3.85 | SSOK.A 128.17,12.51 120.24,4.58 111.19,4.58 111.17,4.6 107.65,4.6 105.98,2.93 v70.55,2.93
SSOK_READ  (via drill 0.35)
  Top 0.254: R3.2 R4.1 56.41,10.15 v57.01,10.15 | v88.25,10.9 88.71,10.43 ATMEGA.19
  Bottom 0.254: v88.25,10.9 79.61,10.9 79.09,10.38 57.24,10.38 v57.01,10.15
THERMAL  (5 unrouted)
  pour Bottom: 22.12,16.9 28.22,16.9 28.22,11.31 22.12,11.31
  pour Bottom: 47.52,17.41 53.62,17.41 53.62,11.82 47.52,11.82
  pour Bottom: 72.41,17.92 78.76,17.92 78.76,14.78 78.64,14.78 77.48,14.78 77.49,14.77 77.49,11.82 72.41,11.82
  pour Bottom: 98.32,17.41 101.36,17.41 104.08,14.69 104.08,14.24 104.42,13.9 104.42,11.31 98.32,11.31
  pour Bottom: 123.72,17.41 129.82,17.41 129.82,11.31 123.72,11.31
THERMAL5
  pour Bottom: 149.12,16.9 155.22,16.9 155.22,11.31 149.12,11.31
TX
  Top 0.254: MCP2515.1 74.98,20.75 75.74,19.99 75.74,13.23 72.7,10.19 72.66,10.19 72.31,9.84 72.31,6.57 73.13,5.75 MCP2551.1

### Text on the board
tNames: Z2 | HyTech Racing / Dashboard rev2 | Z1 | Updated by Ethan Weinstock / Based on the design by Leo Pozdneev 2020 | MCP2551